# EAGLE schematic IO4-CMRI-Interface (EAGLE 6.4)
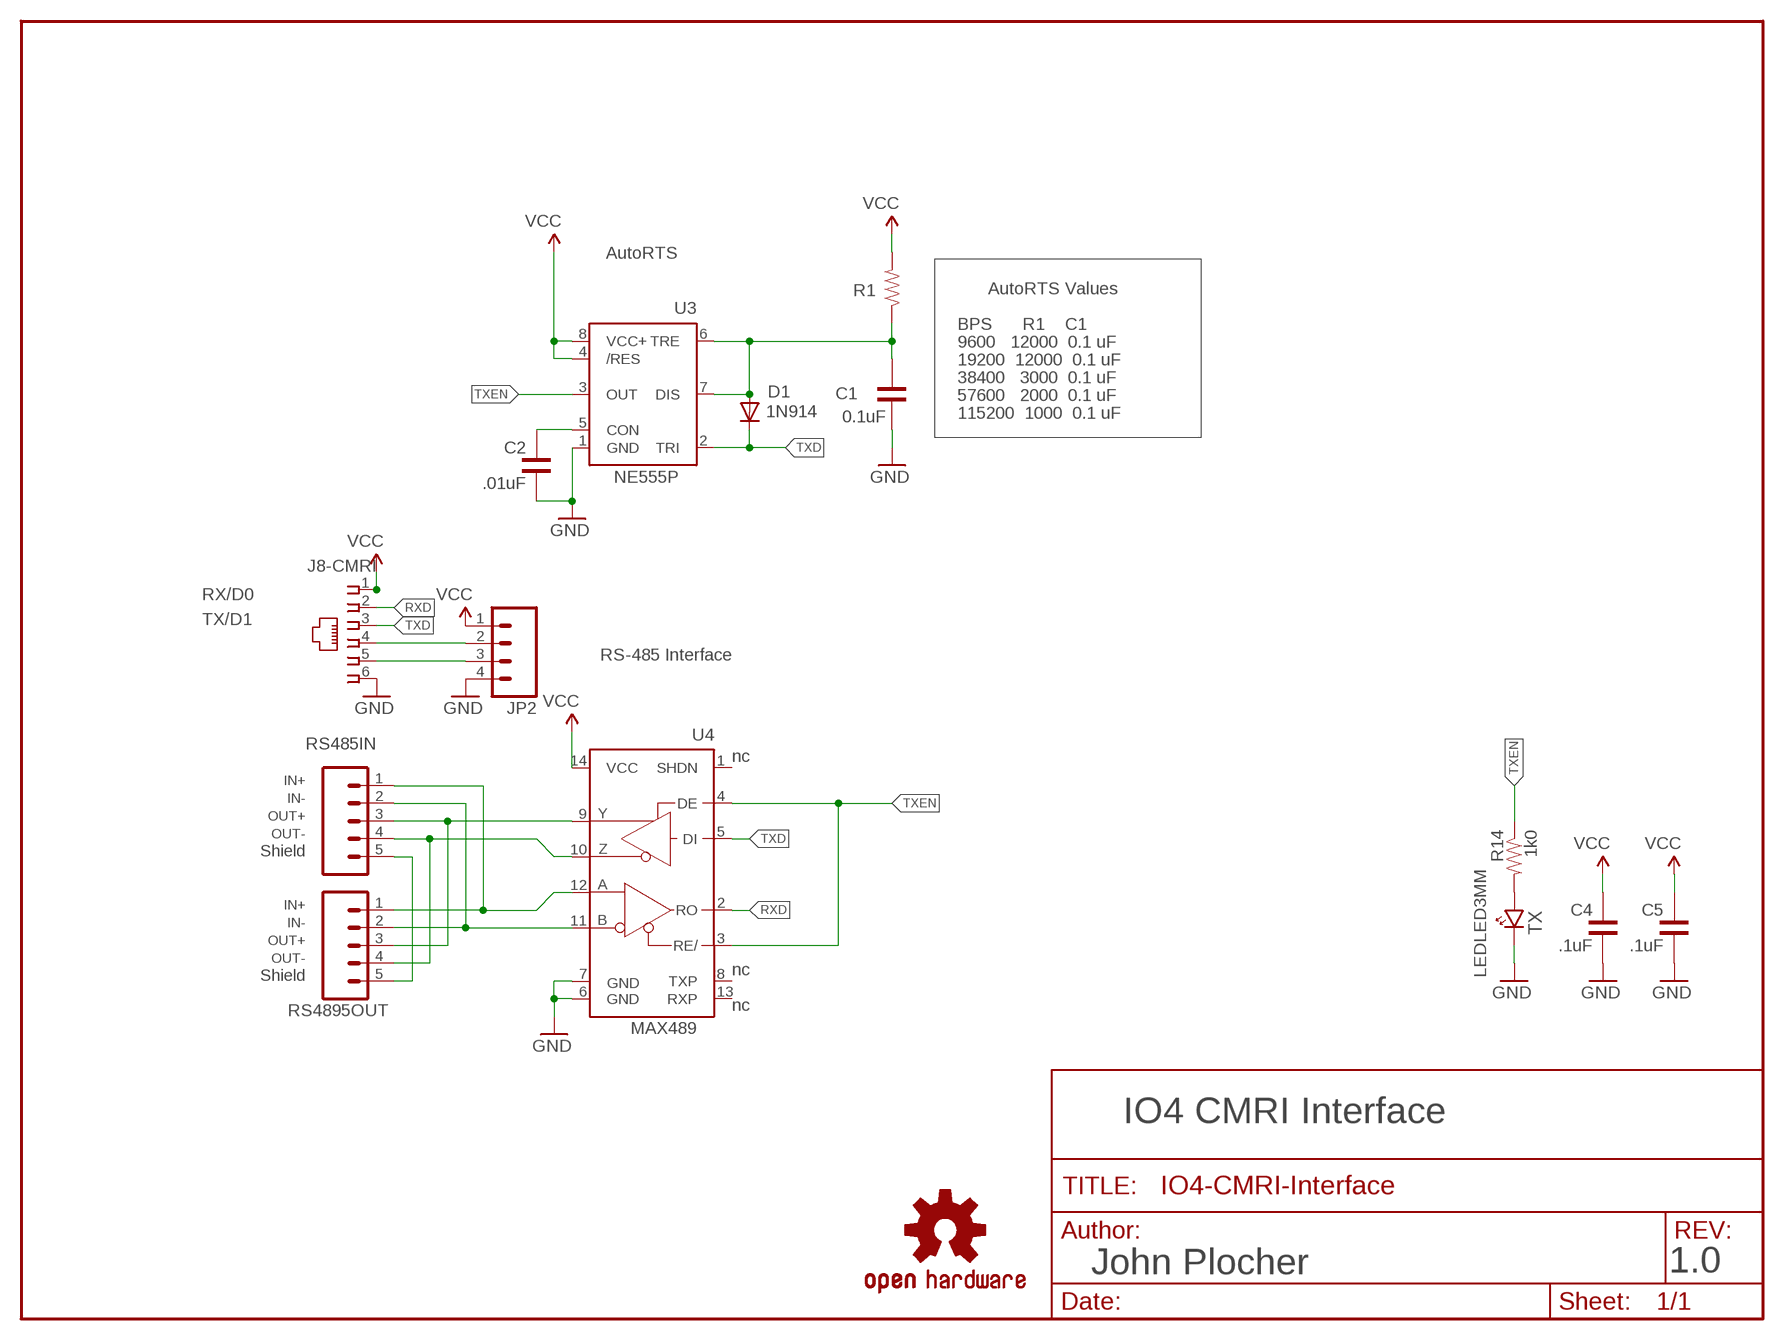
[diagram p0: schematic, sheet 1]

## Parts
C1  0.1uF  CPTH  [CAP-PTH-SMALL]
C2  .01uF  CPTH  [CAP-PTH-SMALL]
C4  .1uF  CPTH  [CAP-PTH-SMALL]
C5  .1uF  CPTH  [CAP-PTH-SMALL]
D1  1N914  DIODEPTH  [DIODE-1N4001]
J8-CMRI  RJ12CORCOM  [RJ11-NO_SHIELD]
JP2  M04SCREW_LOCK  [SCREWTERMINAL-3.5MM-4_LOCK]
R1  RPTH-1/6W  [1/6W-RES]
R14  1k0  RPTH-1/6W  [1/6W-RES]
RS485IN  M05PTH  [1X05]
RS4895OUT  M05LOCK  [1X05_LOCK]
TX  LEDLED3MM  [LED3MM]
U3  NE555P  [DIL-08]
U4  MAX3465CPD  [DIL14]
U$1  OSHW-LOGOL  [OSHW-LOGO-L]

## Nets
GND [Power]: C1.2 C2.2 C4.2 C5.2 J8-CMRI.6 JP2.4 TX.K(C) U3.1(GND) U4.6(GND) U4.7(GND)
IN+: RS485IN.1 RS4895OUT.1 U4.12(A)
IN-: RS485IN.2 RS4895OUT.2 U4.11(B)
N$1: C1.1 D1.A R1.1 U3.6(TRE) U3.7(DIS)
N$2: J8-CMRI.4 JP2.2
N$3: J8-CMRI.5 JP2.3
N$29: R14.2 TX.A
N$38: C2.1 U3.5(CON)
OUT+: RS485IN.3 RS4895OUT.3 U4.9(Y)
OUT-: RS485IN.4 RS4895OUT.4 U4.10(Z)
RXD: J8-CMRI.2 U4.2(RO)
SHIELD: RS485IN.5 RS4895OUT.5
TXD: D1.C J8-CMRI.3 U3.2(TRI) U4.5(DI)
TXEN: R14.1 U3.3(OUT) U4.3(RE/) U4.4(DE)
VCC [Power]: C4.1 C5.1 J8-CMRI.1 JP2.1 R1.2 U3.4(/RES) U3.8(VCC+) U4.14(VCC)
Unconnected: U4.1(SHDN) U4.8(TXP) U4.13(RXP)

## Notes on the sheet
- AutoRTS
- AutoRTS Values
- BPS      R1    C1
- 9600   12000  0.1 uF
- 19200  12000  0.1 uF
- 38400   3000  0.1 uF
- 57600   2000  0.1 uF
- 115200  1000  0.1 uF
- RX/D0
- TX/D1
- RS-485 Interface
- nc
- IN+
- IN-
- OUT+
- OUT-
- Shield
- IN+
- IN-
- OUT+
- OUT- | nc
- Shield
- nc
- MAX489
- IO4 CMRI Interface
- John Plocher | 1.0

## Library data of the parts
C1 C2 C4 C5 = SPCoast:C*: Capacitor Standard 0603 ceramic capacitor, and 0.1" leaded capacitor.
D1 = MCP:DIODE: Diode These are standard reverse protection diodes and small signal diodes. SMA package can handle up to about 1A. SOD-323 can handle about 200mA. What the SOD-323 package when ordering, there are some mfgs out there that are 5-pin packages.
J8-CMRI = SPCoast:RJ12: AMP connector
JP2 = SparkFun-Connectors:M04: Header 4 Standard 4-pin 0.1" header. Use with straight break away headers (SKU : PRT-00116), right angle break away headers (PRT-00553), swiss pins (PRT-00743), machine pins (PRT-00117), and female headers (PRT-00115). Molex polarized connector foot print use with SKU : PRT-08231 with associated crimp pins and housings. 1MM SMD Version SKU: PRT-10208
R1 R14 = SPCoast:R*: Resistor Basic schematic elements and footprints for 0603, 1206, and PTH 1/10th watt (small) resistors.
RS485IN RS4895OUT = SparkFun:M05: Header 5 Standard 5-pin 0.1" header. Use with straight break away headers (SKU : PRT-00116), right angle break away headers (PRT-00553), swiss pins (PRT-00743), machine pins (PRT-00117), and female headers (PRT-00115). Molex polarized connector foot print use with SKU : PRT-08230 with associated crimp pins and housings.
TX = SPCoast:LED*
U3 = SparkFun:NE555: General purpose bipolar Timer; MF: Arrow Electronics; MPN: NE555N; OC_FARNELL: 1467742; OC_NEWARK: 89K1486
U4 = maxim:MAX346*: +5V, Fail-Safe, 40Mbps, Profibus RS-485/RS-422 Transceivers Source: MAX3465-MAX3469.pdf; MPN: MAX3465CPD+; OC_FARNELL: unknown; OC_NEWARK: 42M5444
U$1 = SparkFun:OSHW-LOGO: Open Source Hardware Logo This logo indicates the piece of hardware it is found on incorporates a OSHW license and/or adheres to the definition of open source hardware found here: http://freedomdefined.org/OSHW

## Net classes
0 default: width 0.203 mm, drill 0.6 mm
1 Power: width 0.406 mm, drill 0.6 mm
2 signals: width 0.254 mm, drill 0.6 mm